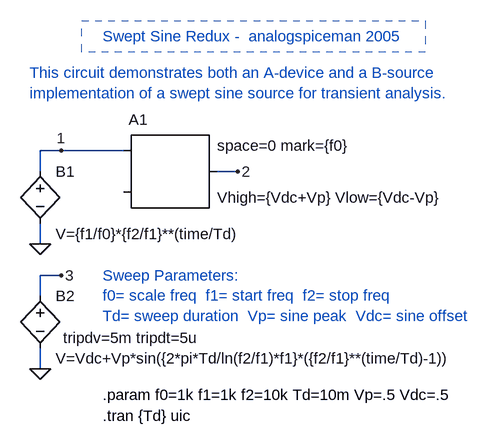
[diagram p0: schematic Swept_Sine_Redux.asc]
Swept_Sine_Redux.asc, the LTspice schematic file:
Version 4
SHEET 1 1180 768
WIRE 112 192 112 160
WIRE 112 304 112 272
WIRE 112 384 112 352
WIRE 112 496 112 464
WIRE 144 160 112 160
WIRE 144 352 112 352
WIRE 240 160 144 160
WIRE 416 192 384 192
FLAG 112 304 0
FLAG 144 160 1
FLAG 416 192 2
FLAG 112 496 0
FLAG 144 352 3
SYMBOL SpecialFunctions\\modulate 240 160 R0
WINDOW 3 144 -8 Left 0
WINDOW 0 8 -48 Left 0
WINDOW 123 144 72 Left 0
SYMATTR Value space=0 mark={f0}
SYMATTR InstName A1
SYMATTR Value2 Vhigh={Vdc+Vp} Vlow={Vdc-Vp}
SYMBOL bv 112 176 R0
WINDOW 3 24 112 Left 0
SYMATTR Value V={f1/f0}*{f2/f1}**(time/Td)
SYMATTR InstName B1
SYMBOL bv 112 368 R0
WINDOW 3 24 112 Left 0
WINDOW 123 35 80 Left 0
SYMATTR Value V=Vdc+Vp*sin({2*pi*Td/ln(f2/f1)*f1}*({f2/f1}**(time/Td)-1))
SYMATTR InstName B2
SYMATTR Value2 tripdv=5m tripdt=5u
TEXT 208 568 Left 0 !.tran {Td} uic
TEXT 208 536 Left 0 !.param f0=1k f1=1k f2=10k Td=10m Vp=.5 Vdc=.5
TEXT 208 352 Left 0 ;Sweep Parameters:\nf0= scale freq  f1= start freq  f2= stop freq\nTd= sweep duration  Vp= sine peak  Vdc= sine offset
TEXT 96 40 Left 0 ;This circuit demonstrates both an A-device and a B-source \nimplementation of a swept sine source for transient analysis.
TEXT 440 -16 Center 0 ;Swept Sine Redux -  analogspiceman 2005
RECTANGLE Normal 704 8 176 -40 1

The netlist it stands for:
* Swept_Sine_Redux.asc
A1 1 0 0 0 0 0 2 0 MODULATOR space=0 mark={f0} Vhigh={Vdc+Vp} Vlow={Vdc-Vp}
B1 1 0 V={f1/f0}*{f2/f1}**(time/Td)
B2 3 0 V=Vdc+Vp*sin({2*pi*Td/ln(f2/f1)*f1}*({f2/f1}**(time/Td)-1)) tripdv=5m tripdt=5u
.tran {Td} uic
.param f0=1k f1=1k f2=10k Td=10m Vp=.5 Vdc=.5
* Sweep Parameters:
* f0= scale freq  f1= start freq  f2= stop freq
* Td= sweep duration  Vp= sine peak  Vdc= sine offset
* This circuit demonstrates both an A-device and a B-source
* implementation of a swept sine source for transient analysis.
* Swept Sine Redux -  analogspiceman 2005
.backanno
.end